# EAGLE design Kiln_V1 (EAGLE 7.6.0)
DESIGN: Kiki Jewell; REV: 2.0
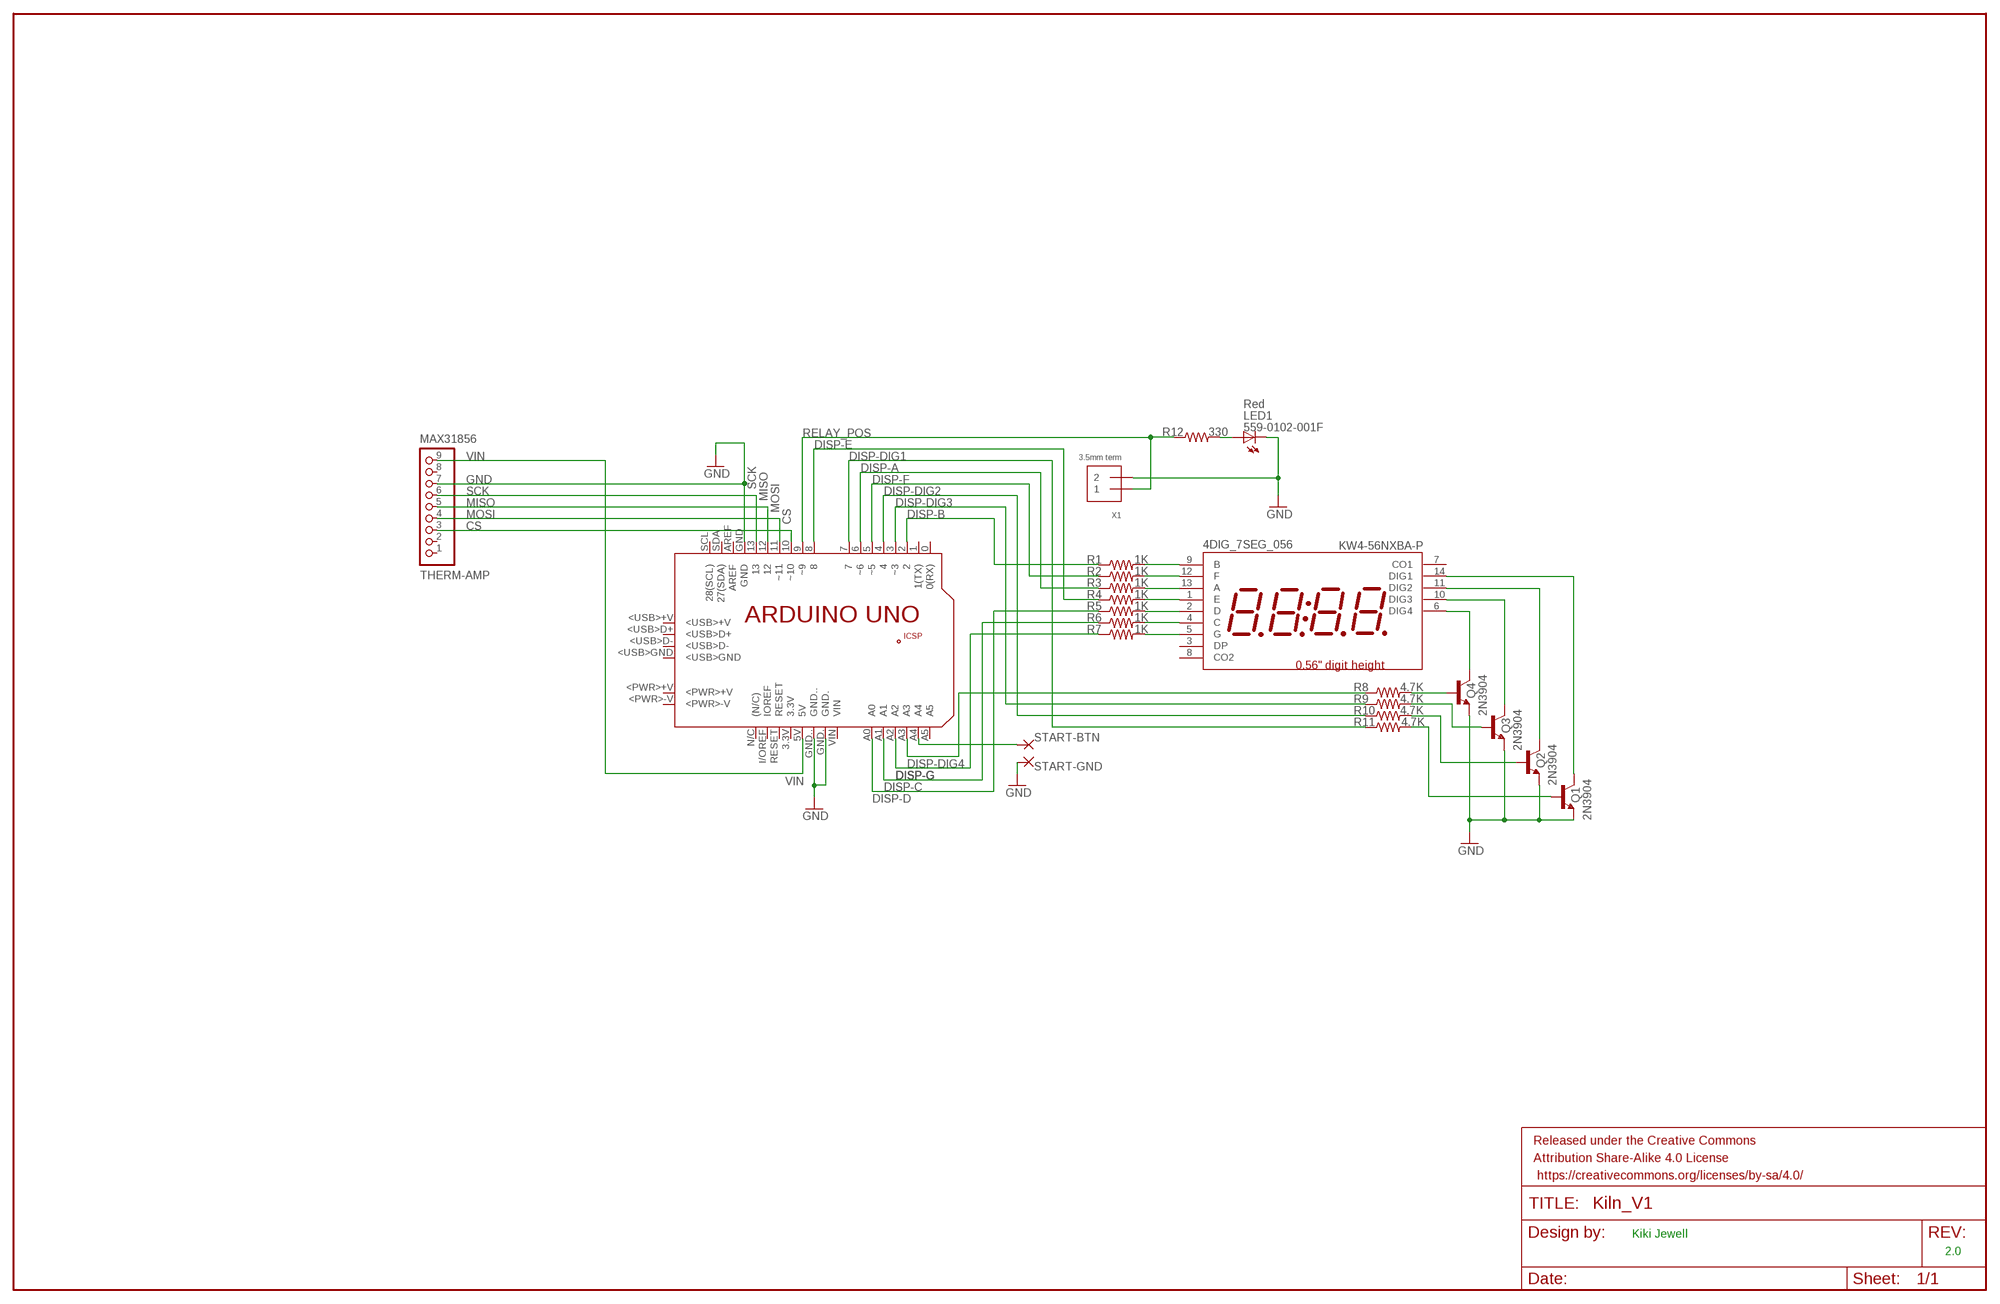
[diagram p0: schematic, sheet 1]

## Parts
4DIG_7SEG_056  KW4-56NXBA-P  4DIG_7SEG_056  [4DIG_7SEG_056]
FRAME1  FRAME-LEDGER  [CREATIVE_COMMONS]
LED1  559-0102-001F  LED3MM  [LED3MM]
PCB1  ARDUINO_UNO  [ARDUINO_UNO]
Q1  2N3904  [TO92]
Q2  2N3904  [TO92]
Q3  2N3904  [TO92]
Q4  2N3904  [TO92]
R1  1K  RESISTOR1206  [1206]
R2  1K  RESISTOR1206  [1206]
R3  1K  RESISTOR1206  [1206]
R4  1K  RESISTOR1206  [1206]
R5  1K  RESISTOR1206  [1206]
R6  1K  RESISTOR1206  [1206]
R7  1K  RESISTOR1206  [1206]
R8  4.7K  RESISTOR1206  [1206]
R9  4.7K  RESISTOR1206  [1206]
R10  4.7K  RESISTOR1206  [1206]
R11  4.7K  RESISTOR1206  [1206]
R12  330  RESISTOR1206  [1206]
START-BTN  WIREPAD2,54/1,1  [2,54/1,1]
START-GND  WIREPAD2,54/1,1  [2,54/1,1]
THERM-AMP  MAX31856  HEADER-1X970MIL  [1X09_ROUND_70]
X1  3.5mm term  TERMBLOCK_1X2  [TERMBLOCK_1X2-3.5MM]

## Nets
A: 4DIG_7SEG_056.13(A) R3.2
B: 4DIG_7SEG_056.9(B) R1.2
C: 4DIG_7SEG_056.4(C) R6.2
CS: PCB1.10(~10) THERM-AMP.3
D: 4DIG_7SEG_056.2(D) R5.2
DIG1: 4DIG_7SEG_056.14(DIG1) Q1.1(C)
DIG2: 4DIG_7SEG_056.11(DIG2) Q2.1(C)
DIG3: 4DIG_7SEG_056.10(DIG3) Q3.1(C)
DIG4: 4DIG_7SEG_056.6(DIG4) Q4.1(C)
DISP-A: PCB1.6(~6) R3.1
DISP-B: PCB1.2 R1.1
DISP-C: PCB1.A1 R6.1
DISP-D: PCB1.A0 R5.1
DISP-DIG1: PCB1.7 R11.1
DISP-DIG2: PCB1.4 R10.1
DISP-DIG3: PCB1.3(~3) R9.1
DISP-DIG4: PCB1.A3 R8.1
DISP-E: PCB1.8 R4.1
DISP-F: PCB1.5(~5) R2.1
DISP-G: PCB1.A2 R7.1
E: 4DIG_7SEG_056.1(E) R4.2
F: 4DIG_7SEG_056.12(F) R2.2
G: 4DIG_7SEG_056.5(G) R7.2
GND: LED1.K(C) PCB1.GND PCB1.GND. PCB1.GND.. Q1.3(E) Q2.3(E) Q3.3(E) Q4.3(E) START-GND.1(P) THERM-AMP.7 X1.2
MISO: PCB1.12 THERM-AMP.5
MOSI: PCB1.11(~11) THERM-AMP.4
R8: Q4.2(B) R8.2
R9: Q3.2(B) R9.2
R10: Q2.2(B) R10.2
R11: Q1.2(B) R11.2
R12: LED1.A R12.2
RELAY_POS: PCB1.9(~9) R12.1 X1.1
SCK: PCB1.13 THERM-AMP.6
START-NET: PCB1.A4 START-BTN.1(P)
VIN: PCB1.5V THERM-AMP.9
Unconnected: 4DIG_7SEG_056.3(DP) 4DIG_7SEG_056.7(CO1) 4DIG_7SEG_056.8(CO2) PCB1.0(0(RX)) PCB1.1(1(TX)) PCB1.3.3V PCB1.+5V PCB1.<PWR>+V PCB1.<PWR>-V PCB1.<USB>+V PCB1.<USB>D+ PCB1.<USB>D- PCB1.<USB>GND PCB1.A5 PCB1.AREF PCB1.GND_ PCB1.I/OREF(IOREF) PCB1.MISO PCB1.MOSI PCB1.N/C((N/C)) PCB1.RESET PCB1.RESET. PCB1.SCK PCB1.SCL(28(SCL)) PCB1.SDA(27(SDA)) PCB1.VIN THERM-AMP.1 THERM-AMP.2 THERM-AMP.8

## Library data of the parts
4DIG_7SEG_056 = 7-seg-disp:4DIG_7SEG_056
FRAME1 = Kiln_V2_0.0:FRAME-LEDGER: Schematic Frame Standard 11x14 US Ledger frame
LED1 = 1-Generic:LED: LEDs Standard schematic elements and footprints for 5mm, 3mm, 1206, and 0603 sized LEDs. 5mm - Spark Fun Electronics SKU : COM-00529 (and others); LABEL: Red
PCB1 = E14_Arduino_revC:ARDUINO_UNO: Device for representing an Arduino Uno board with a footprint in an EAGLE design. Created by Dave Young for Element14. More EAGLE documentation at: http://www.element14.com/community/community/knode/cadsoft_eagle
Q1-Q4 = transistor:2N3904: NPN TRANSISTOR
R1-R12 = 1-Generic:RESISTOR: Resistor Basic schematic elements and footprints for 0603, 1206, and PTH 1/10th watt (small) resistors.
START-BTN START-GND = wirepad:WIREPAD: Wire PAD connect wire on PCB
THERM-AMP = microbuilder:HEADER-1X9: PIN HEADER
X1 = microbuilder:TERMBLOCK_1X2: 3.5mm Terminal block http://www.ladyada.net/library/pcb/eaglelibrary.html

## Board
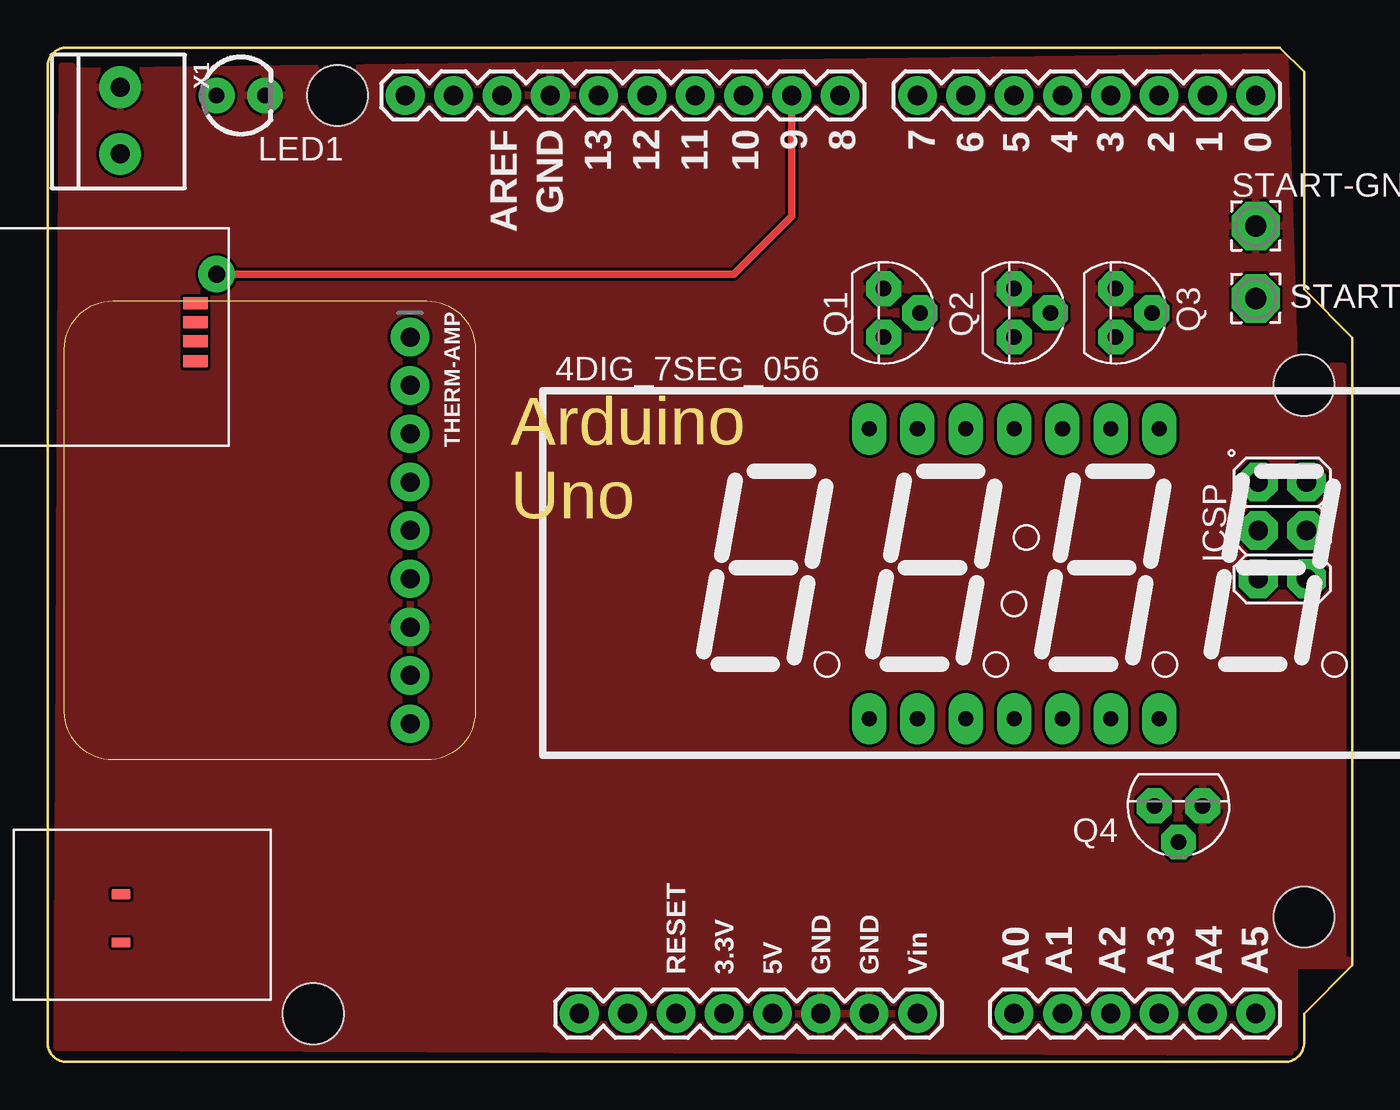
[diagram p1: board, top side]
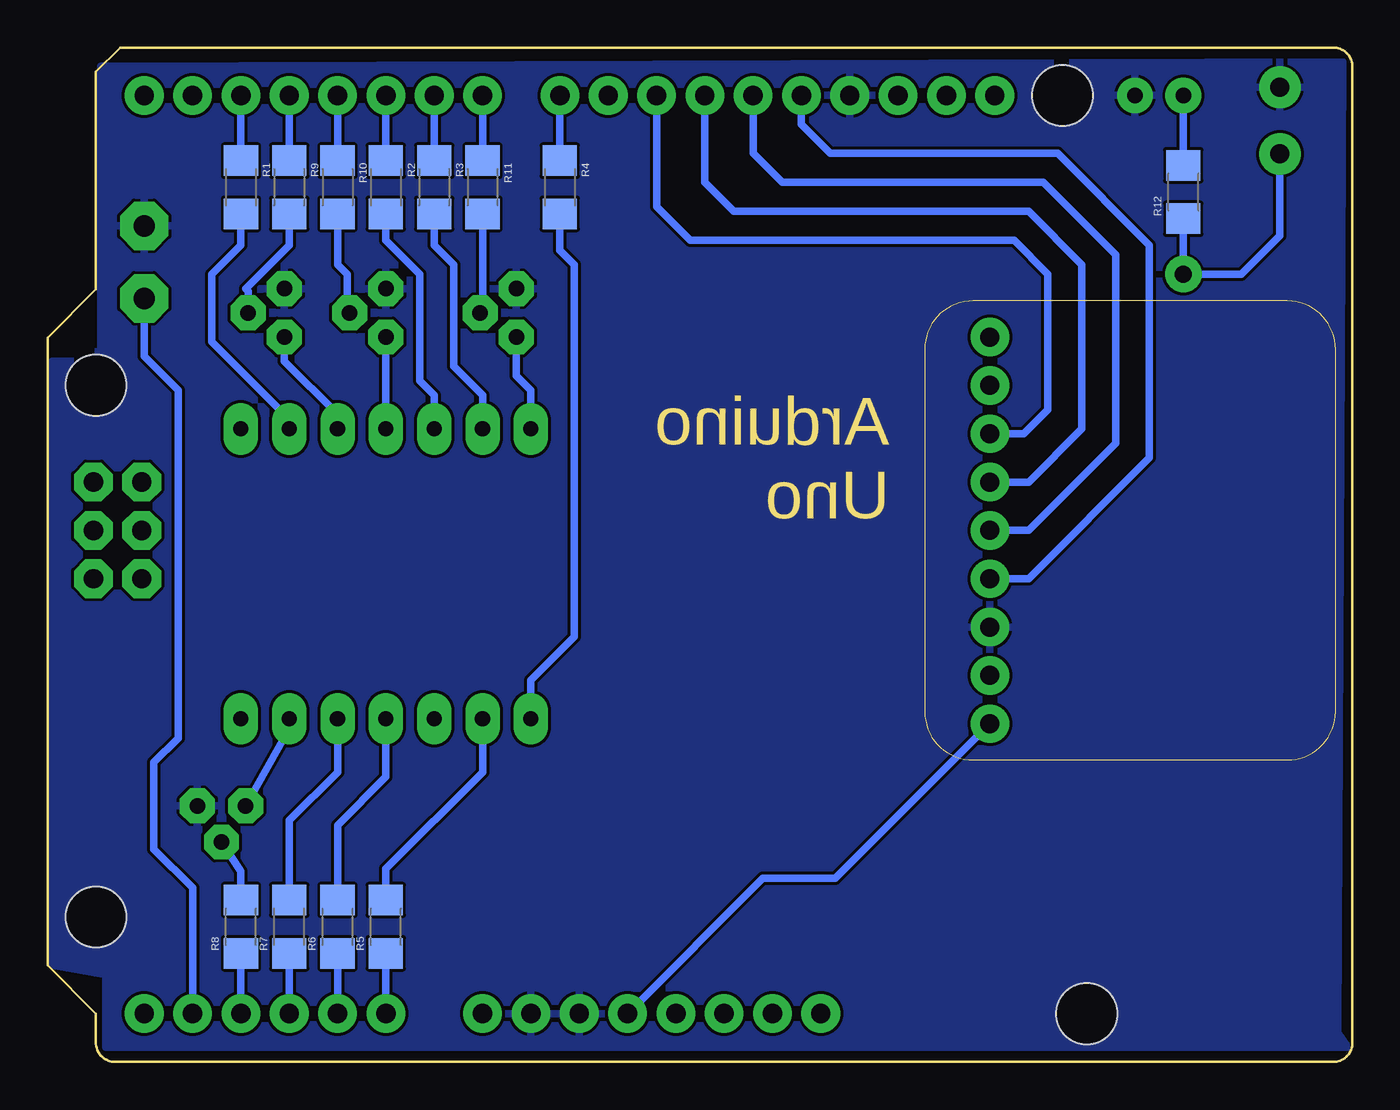
[diagram p2: board, bottom side, seen from below]

Size 68.58 x 53.31 mm. Coordinates in mm from the lower left corner, seen from the top.
Outline: 3.43,40.01 19.94,40.01 arc-90 22.48,37.47 22.48,18.41 arc-90 19.94,15.88 3.43,15.88 arc-90 0.89,18.41 0.89,37.47 arc-90 3.43,40.01
Copper layers (1*16): Top 0.035mm / dielectric 1.5mm / Bottom 0.035mm
Design rules "EA OthermillDRC_30_deg_v2 *": minimum track width 6mil, minimum drill 0.8mm, track to track 6mil, track to pad 6mil, pad to pad 6mil, via to via 6mil, smd to smd 0mil, copper to edge 0mil, drill to drill 6mil, minimum pad ring 20mil, minimum via ring 20mil, stop-mask expansion 1mil, vias tented up to drill 30mil, thermal gap 6mil

### Footprints (pad centres in the part's own frame; a part is rotated, then mirrored left to right if it is on the bottom)
4DIG_7SEG_056 = drill 0.8 long: 1 -7.62,-7.62; 2 -5.08,-7.62; 3 -2.54,-7.62; 4 0,-7.62; 5 2.54,-7.62; 6 5.08,-7.62; 7 7.62,-7.62; 8 7.62,7.62; 9 5.08,7.62; 10 2.54,7.62; 11 0,7.62; 12 -2.54,7.62; 13 -5.08,7.62; 14 -7.62,7.62
LED3MM = drill 0.813 pad 1.88: A -1.27,0; K 1.27,0
ARDUINO_UNO = drill 1.016 pad 1.88: 0 63.5,50.8; 1 60.96,50.8; 2 58.42,50.8; 3 55.88,50.8; 3.3V 35.56,2.54; 4 53.34,50.8; 5 50.8,50.8; 5V 38.1,2.54; 6 48.26,50.8; 7 45.72,50.8; 8 41.656,50.8; 9 39.116,50.8; 10 36.576,50.8; 11 34.036,50.8; 12 31.496,50.8; 13 28.956,50.8; A0 50.8,2.54; A1 53.34,2.54; A2 55.88,2.54; A3 58.42,2.54; A4 60.96,2.54; A5 63.5,2.54; AREF 23.876,50.8; GND 26.416,50.8; GND. 43.18,2.54; GND.. 40.64,2.54; I/OREF 30.48,2.54; N/C 27.94,2.54; RESET 33.02,2.54; SCL 18.796,50.8; SDA 21.336,50.8; VIN 45.72,2.54 | drill 1.016 pad 1.88 octagon: +5V 66.167,30.48; GND_ 66.167,25.4; MISO 63.627,30.48; MOSI 66.167,27.94; RESET. 63.627,25.4; SCK 63.627,27.94 | smd 1.016 x 0.508: <PWR>+V 3.861,8.814; <PWR>-V 3.861,6.274 | smd 1.27 x 0.635: <USB>+V 7.772,39.878; <USB>D+ 7.772,38.887; <USB>D- 7.772,37.871; <USB>GND 7.772,36.83 | hole 3.2: 66.04,7.62; 66.04,35.56; 15.24,50.8; 13.97,2.54
TO92 = drill 0.813 octagon: 1 1.27,0; 2 0,1.905; 3 -1.27,0
1206 = smd 1.6 x 1.8: 1 -1.4,0; 2 1.4,0
2,54/1,1 = drill 1.118 pad 2.54 octagon: 1 0,0
1X09_ROUND_70 = drill 1 pad 1.778: 1 -10.16,0; 2 -7.62,0; 3 -5.08,0; 4 -2.54,0; 5 0,0; 6 2.54,0; 7 5.08,0; 8 7.62,0; 9 10.16,0
TERMBLOCK_1X2-3.5MM = drill 1 pad 2.184: 1 1.8,0; 2 -1.7,0

### Placement (x,y rotation side)
4DIG_7SEG_056  50.8,25.65 0 top
FRAME1  17.53,81.28 0 top  (outside the outline)
LED1  10.16,50.8 0 top
PCB1  0,0 0 top
Q1  43.94,39.37 270 top
Q2  50.8,39.37 270 top
Q3  56.13,39.37 270 top
Q4  59.44,13.46 180 top
R1  58.42,45.97 270 bottom
R2  50.8,45.97 270 bottom
R3  48.26,45.97 270 bottom
R4  41.66,45.97 270 bottom
R5  50.8,7.11 90 bottom
R6  53.34,7.11 90 bottom
R7  55.88,7.11 90 bottom
R8  58.42,7.11 90 bottom
R9  55.88,45.97 270 bottom
R10  53.34,45.97 270 bottom
R11  45.72,45.97 270 bottom
R12  8.89,45.72 90 bottom
START-BTN  63.5,40.13 0 top
START-GND  63.5,43.94 0 top
THERM-AMP  19.05,27.94 270 top
X1  3.81,49.53 270 top

### Tracks (layer width: path | path; a pad name or v marks a point on that pad's centre or on a via)
A
  Bottom 0.406: R3.2 48.26,42.93 47.24,41.91 47.24,36.58 45.72,35.05 4DIG_7SEG_056.13
B
  Bottom 0.406: R1.2 58.42,42.93 59.94,41.4 59.94,37.85 55.88,33.78 4DIG_7SEG_056.9
C
  Bottom 0.406: 4DIG_7SEG_056.4 50.8,14.99 53.34,12.45 R6.2
CS
  Bottom 0.406: PCB1.10 36.58,44.96 34.8,43.18 17.78,43.18 16,41.4 16,34.29 17.27,33.02 THERM-AMP.3
D
  Bottom 0.406: 4DIG_7SEG_056.2 45.72,15.24 50.8,10.16 R5.2 50.8,8.38
DIG1
  Bottom 0.406: Q1.1 43.94,36.07 43.18,35.31 4DIG_7SEG_056.14
DIG2
  Bottom 0.406: Q2.1 4DIG_7SEG_056.11
DIG3
  Bottom 0.406: Q3.1 56.13,36.83 53.34,34.04 4DIG_7SEG_056.10
DIG4
  Bottom 0.406: 4DIG_7SEG_056.6 55.88,17.53 Q4.1
DISP-A
  Bottom 0.406: PCB1.6 R3.1
DISP-B
  Bottom 0.406: PCB1.2 R1.1
DISP-C
  Bottom 0.406: R6.1 PCB1.A1
DISP-D
  Bottom 0.406: R5.1 PCB1.A0
DISP-DIG1
  Bottom 0.406: PCB1.7 R11.1 45.72,46.99
DISP-DIG2
  Bottom 0.406: PCB1.4 R10.1
DISP-DIG3
  Bottom 0.406: PCB1.3 R9.1
DISP-DIG4
  Bottom 0.406: R8.1 PCB1.A3
DISP-E
  Bottom 0.406: 41.66,47.5 41.79,47.5 R4.1 PCB1.8
DISP-F
  Bottom 0.406: PCB1.5 R2.1
DISP-G
  Bottom 0.406: R7.1 PCB1.A2
E
  Bottom 0.406: 4DIG_7SEG_056.1 43.18,20.07 40.89,22.35 40.89,41.91 41.66,42.67 R4.2
F
  Bottom 0.406: R2.2 50.8,43.18 49.02,41.4 49.02,35.81 48.26,35.05 4DIG_7SEG_056.12
G
  Bottom 0.406: 4DIG_7SEG_056.5 53.34,15.24 55.88,12.7 R7.2
GND
  pour Top: 65.28,0.51 65.28,0.76 65.53,0.76 65.53,5.08 68.33,5.08 68.33,5.33 68.07,5.33 68.07,36.58 65.53,36.58 65.02,52.83 1.27,52.07 1.27,52.32 0.76,52.32 0.51,0.76
  pour Bottom: 0.25,0.76 65.53,0.76 65.53,4.57 68.33,5.08 68.33,36.83 66.04,36.83 66.04,37.34 65.79,37.34 65.79,52.32 0.51,52.58 0.76,1.52
MISO
  Bottom 0.406: PCB1.12 31.5,47.75 29.97,46.23 16.26,46.23 12.45,42.42 12.45,32.51 17.02,27.94 THERM-AMP.5
MOSI
  Bottom 0.406: PCB1.11 34.04,46.23 32.51,44.7 17.02,44.7 14.22,41.91 14.22,33.27 17.02,30.48 THERM-AMP.4
R8
  Bottom 0.406: Q4.2 58.42,10.04 R8.2
R9
  Bottom 0.406: Q3.2 58.04,40.51 58.17,40.64 55.88,42.93 R9.2
R10
  Bottom 0.406: R10.2 53.34,41.91 52.83,41.4 52.83,39.5 Q2.2
R11
  Bottom 0.406: R11.2 45.72,39.5 Q1.2
R12
  Bottom 0.406: LED1.A R12.2
RELAY_POS  (via drill 0.9 pad 1.27)
  Top 0.406: PCB1.9 39.12,44.45 36.07,41.4 v8.89,41.4
  Bottom 0.406: R12.1 v8.89,41.4 5.84,41.4 3.81,43.43 X1.1
SCK
  Bottom 0.406: THERM-AMP.6 17.02,25.4 10.67,31.75 10.67,42.93 15.49,47.75 27.43,47.75 28.96,49.28 PCB1.13
START-NET
  Bottom 0.406: START-BTN.1 63.5,37.08 61.72,35.31 61.72,17.02 62.99,15.75 62.99,11.18 60.96,9.14 PCB1.A4
VIN
  Bottom 0.406: THERM-AMP.9 27.18,9.65 30.99,9.65 PCB1.5V